# Altium schematic sheet pt100.SchDoc
size A4
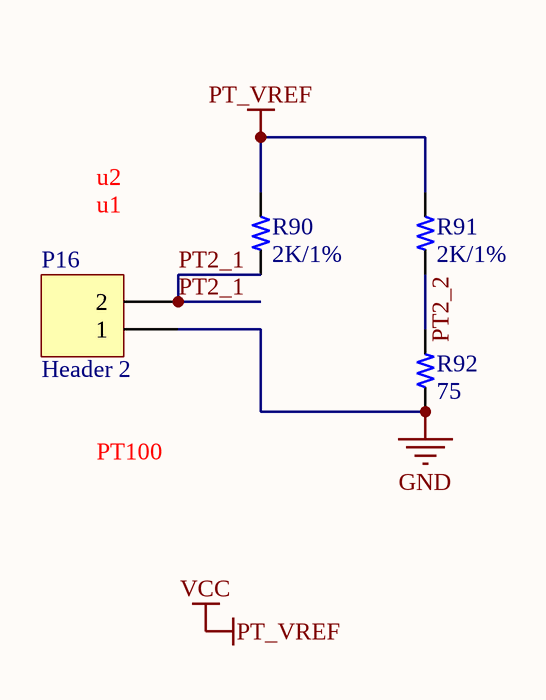
[diagram p0: pt100.SchDoc]

## Parts
P16  Header 2  [KF250NH-3.5-2P]
R90  2K/1%  [0603R]
R91  2K/1%  [0603R]
R92  75  [0603R]

## Nets
GND: P16.1 R92.1
PT_VREF: R90.2 R91.2  [also labelled VCC]
PT2_1: P16.2 R90.1
PT2_2: R91.1 R92.2

## Notes on the sheet
- (near P16) u1
- u2
- PT100

## Library data of the parts
R90-R92 = R
  R90 R91: Value: 2K/1%
  R92: Value: 75
P16 = Header 2: Publisher: Altium Limited; Value: Header 2